# Altium schematic sheet CE842170260_SHEET2.SchDoc
size Tabloid; Revision: P; SheetNumber: 1; SheetTotal: 1; PageSetup: Record=PageOptions|CenterHorizontal=True|CenterVertical=True|PrintScale=0.75|XCorrection=1.00|YCorrection=1.00|PrintKind=0|BorderSize=5000000|LeftOffset=0|BottomOffset=0|Orientation=2|PaperLength=1000|PaperWidth=1000|Scale=100|PaperSource=7|PrintQuality=-4|MediaType=1|DitherType=10|PaperKind=A4|PrintScaleMode=1; Rule: PcbType=ProtelPcb
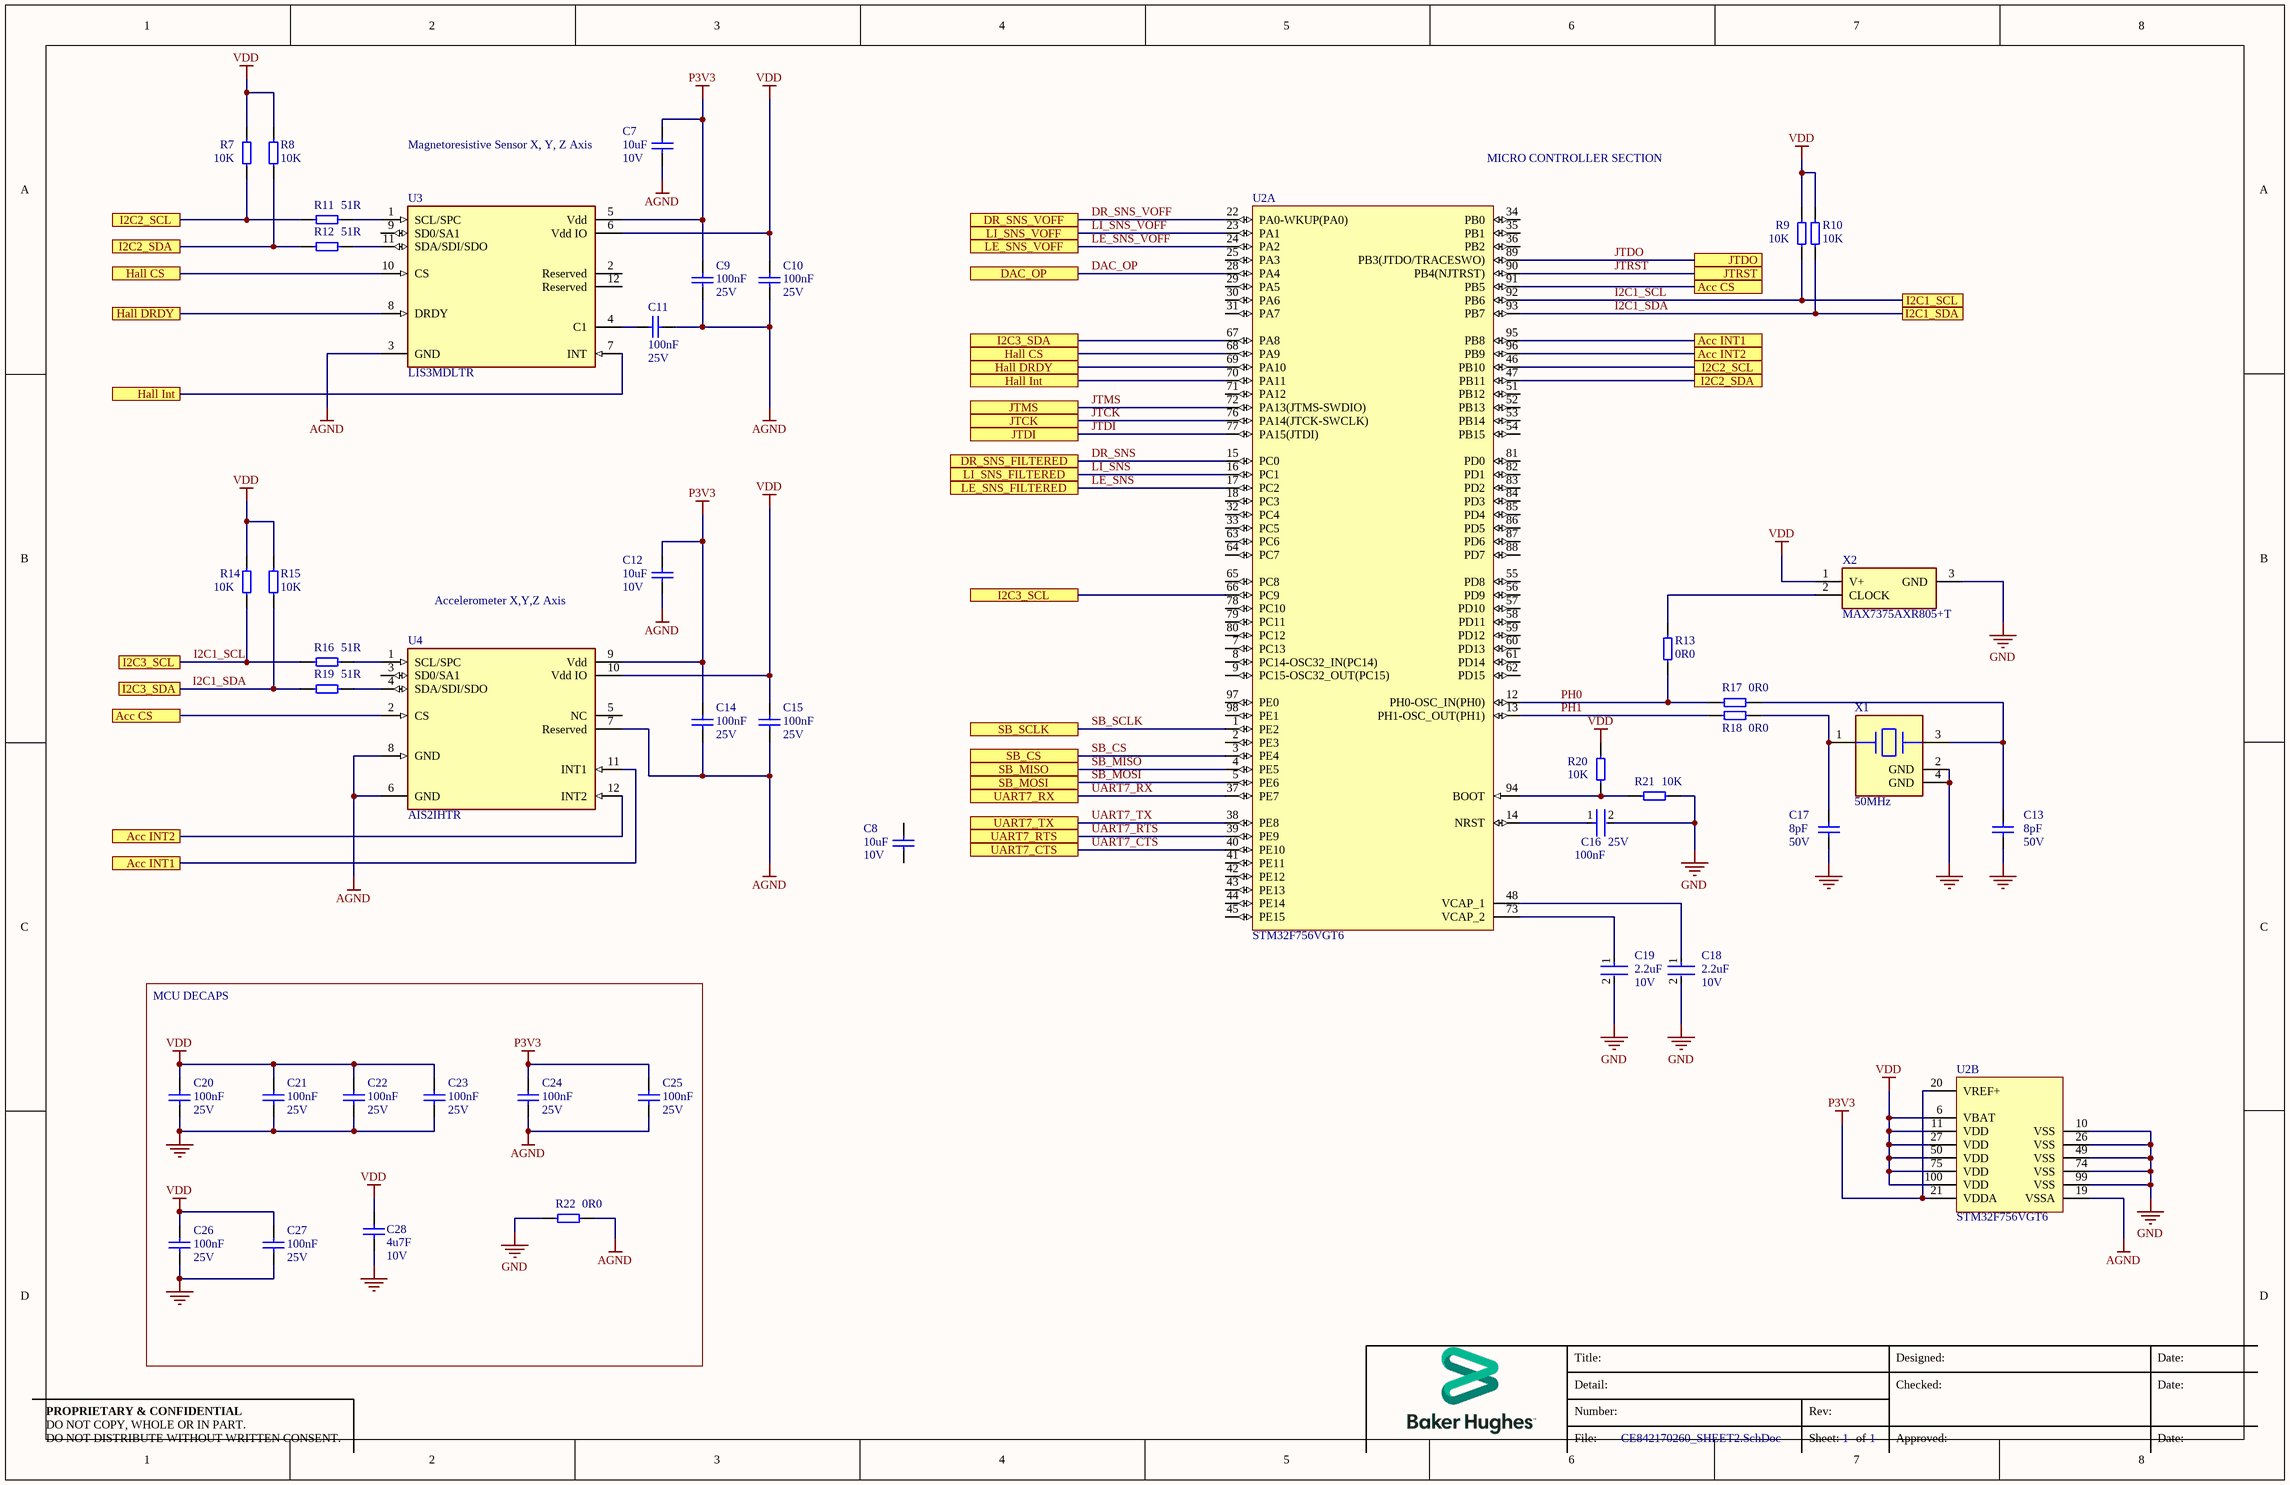
[diagram p0: CE842170260_SHEET2.SchDoc]

## Parts
C7  value 10uF  Voltage: 10V  [C0603]  (hidden comment: KK/96159/3701)
C8  value 10uF  Voltage: 10V  [C0603]  (hidden comment: KK/96159/3701)
C9  value 100nF  Voltage: 25V  [C0603]  (hidden comment: KK/96159/4501)
C10  value 100nF  Voltage: 25V  [C0603]  (hidden comment: KK/96159/4501)
C11  value 100nF  Voltage: 25V  [C0603]  (hidden comment: KK/96159/4501)
C12  value 10uF  Voltage: 10V  [C0603]  (hidden comment: KK/96159/3701)
C13  value 8pF  Voltage: 50V  [C0603]  (hidden comment: KK/96159/0088)
C14  value 100nF  Voltage: 25V  [C0603]  (hidden comment: KK/96159/4501)
C15  value 100nF  Voltage: 25V  [C0603]  (hidden comment: KK/96159/4501)
C16  Voltage Rating (DC): 25V  Capacitance: 100nF  [FP-C1005-050-0_05-MFG]  (hidden comment: C1005X5R1E104K050BC)
C17  value 8pF  Voltage: 50V  [C0603]  (hidden comment: KK/96159/0088)
C18  Voltage Rating: 10V  Capacitance: 2.2uF  [FP-CGB3B-IPC_A]  (hidden comment: CGB3B3X5R1A225M055AB)
C19  Voltage Rating: 10V  Capacitance: 2.2uF  [FP-CGB3B-IPC_A]  (hidden comment: CGB3B3X5R1A225M055AB)
C20  value 100nF  Voltage: 25V  [C0603]  (hidden comment: KK/96159/4501)
C21  value 100nF  Voltage: 25V  [C0603]  (hidden comment: KK/96159/4501)
C22  value 100nF  Voltage: 25V  [C0603]  (hidden comment: KK/96159/4501)
C23  value 100nF  Voltage: 25V  [C0603]  (hidden comment: KK/96159/4501)
C24  value 100nF  Voltage: 25V  [C0603]  (hidden comment: KK/96159/4501)
C25  value 100nF  Voltage: 25V  [C0603]  (hidden comment: KK/96159/4501)
C26  value 100nF  Voltage: 25V  [C0603]  (hidden comment: KK/96159/4501)
C27  value 100nF  Voltage: 25V  [C0603]  (hidden comment: KK/96159/4501)
C28  value 4u7F  Voltage: 10V  [C0603]  (hidden comment: KK/96159/2666)
R7  value 10K  [R0603]  (hidden comment: KK/96059/0601)
R8  value 10K  [R0603]  (hidden comment: KK/96059/0601)
R9  value 10K  [R0603]  (hidden comment: KK/96059/0601)
R10  value 10K  [R0603]  (hidden comment: KK/96059/0601)
R11  value 51R  [R0603]  (hidden comment: KK/96059/1369)
R12  value 51R  [R0603]  (hidden comment: KK/96059/1369)
R13  value 0R0  [R0603]  (hidden comment: KK/96059/0000)
R14  value 10K  [R0603]  (hidden comment: KK/96059/0601)
R15  value 10K  [R0603]  (hidden comment: KK/96059/0601)
R16  value 51R  [R0603]  (hidden comment: KK/96059/1369)
R17  value 0R0  [R0603]  (hidden comment: KK/96059/0000)
R18  value 0R0  [R0603]  (hidden comment: KK/96059/0000)
R19  value 51R  [R0603]  (hidden comment: KK/96059/1369)
R20  value 10K  [R0603]  (hidden comment: KK/96059/0601)
R21  value 10K  [R0603]  (hidden comment: KK/96059/0601)
R22  value 0R0  [R0603]  (hidden comment: KK/96059/0000)
U2  MF_PartNumber: STM32F756VGT6  [LQFP-100]  (hidden comment: KK/95414/0147)  (parts A,B of 2)
U3  MF_PartNumber: LIS3MDLTR  [LGA-12]  (hidden comment: KK/95312/0195)
U4  MF_PartNumber: AIS2IHTR  [LGA-12]  (hidden comment: KK/95312/0196)
X1  Frequency: 50MHz  [FP-NX1612SA-MFG]  (hidden comment: NX1612SA-50M-EXS00A-CS08403)
X2  MAX7375AXR805+T  [SOT65P210X110-3N]

## Blocks framed on the sheet
MCU DECAPS: C20-C28 R22

## Ports
Acc CS, Acc INT1, Acc INT2, DAC_OP, DR_SNS_FILTERED, DR_SNS_VOFF, Hall CS, Hall DRDY, Hall Int, I2C1_SCL, I2C1_SDA, I2C2_SCL, I2C2_SDA, I2C3_SCL, I2C3_SDA, JTCK, JTDI, JTDO, JTMS, JTRST, LE_SNS_FILTERED, LE_SNS_VOFF, LI_SNS_FILTERED, LI_SNS_VOFF, SB_CS, SB_MISO, SB_MOSI, SB_SCLK, UART7_CTS, UART7_RTS, UART7_RX, UART7_TX

## Nets
AGND: C7.2 C9.2 C10.2 C11.2 C12.2 C14.2 C15.2 C24.2 C25.2 R22.2 U2.19(VSSA) U3.3(GND) U4.6(GND) U4.7(Reserved) U4.8(GND)
GND: C13.1 C16.2 C17.2 C18.2 C19.2 C20.2 C21.2 C22.2 C23.2 C26.2 C27.2 C28.2 R21.1 R22.1 U2.10(VSS) U2.26(VSS) U2.49(VSS) U2.74(VSS) U2.99(VSS) X1.2(GND) X1.4(GND) X2.3(GND)
P3V3: C7.1 C9.1 C12.1 C14.1 C24.1 C25.1 U2.20(VREF+) U2.21(VDDA) U3.5(Vdd) U4.9(Vdd)
VDD: C10.1 C15.1 C20.1 C21.1 C22.1 C23.1 C26.1 C27.1 C28.1 R7.2 R8.2 R9.2 R10.2 R14.2 R15.2 R20.2 U2.6(VBAT) U2.11(VDD) U2.27(VDD) U2.50(VDD) U2.75(VDD) U2.100(VDD) U3.6(Vdd_IO) U4.10(Vdd_IO) X2.1(V+)
Acc CS: U2.91(PB5) U4.2(CS) ; port Acc CS
Acc INT1: U2.95(PB8) U4.11(INT1) ; port Acc INT1
Acc INT2: U2.96(PB9) U4.12(INT2) ; port Acc INT2
DAC_OP: U2.28(PA4) ; port DAC_OP
DR_SNS: U2.15(PC0) ; port DR_SNS_FILTERED
DR_SNS_VOFF: U2.22(PA0-WKUP(PA0)) ; port DR_SNS_VOFF
Hall CS: U2.68(PA9) U3.10(CS) ; port Hall CS
Hall DRDY: U2.69(PA10) U3.8(DRDY) ; port Hall DRDY
Hall Int: U2.70(PA11) U3.7(INT) ; port Hall Int
I2C1_SCL: R9.1 R14.1 R16.1 U2.66(PC9) U2.92(PB6) ; port I2C1_SCL, port I2C3_SCL
I2C1_SDA: R10.1 R15.1 R19.1 U2.67(PA8) U2.93(PB7) ; port I2C1_SDA, port I2C3_SDA
I2C2_SCL: R7.1 R11.1 U2.46(PB10) ; port I2C2_SCL
I2C2_SDA: R8.1 R12.1 U2.47(PB11) ; port I2C2_SDA
JTCK: U2.76(PA14(JTCK-SWCLK)) ; port JTCK
JTDI: U2.77(PA15(JTDI)) ; port JTDI
JTDO: U2.89(PB3(JTDO/TRACESWO)) ; port JTDO
JTMS: U2.72(PA13(JTMS-SWDIO)) ; port JTMS
JTRST: U2.90(PB4(NJTRST)) ; port JTRST
LE_SNS: U2.17(PC2) ; port LE_SNS_FILTERED
LE_SNS_VOFF: U2.24(PA2) ; port LE_SNS_VOFF
LI_SNS: U2.16(PC1) ; port LI_SNS_FILTERED
LI_SNS_VOFF: U2.23(PA1) ; port LI_SNS_VOFF
PH0: R13.2 R17.1 U2.12(PH0-OSC_IN(PH0))
PH1: R18.1 U2.13(PH1-OSC_OUT(PH1))
SB_CS: U2.3(PE4) ; port SB_CS
SB_MISO: U2.4(PE5) ; port SB_MISO
SB_MOSI: U2.5(PE6) ; port SB_MOSI
SB_SCLK: U2.1(PE2) ; port SB_SCLK
UART7_CTS: U2.40(PE10) ; port UART7_CTS
UART7_RTS: U2.39(PE9) ; port UART7_RTS
UART7_RX: U2.37(PE7) ; port UART7_RX
UART7_TX: U2.38(PE8) ; port UART7_TX
NetC11_1: C11.1 U3.4(C1)
NetC13_2: C13.2 R17.2 X1.3(2_Xtal)
NetC16_1: C16.1 U2.14(NRST)
NetC17_1: C17.1 R18.2 X1.1(1_Xtal)
NetC18_1: C18.1 U2.48(VCAP_1)
NetC19_1: C19.1 U2.73(VCAP_2)
NetR11_2: R11.2 U3.1(SCL/SPC)
NetR12_2: R12.2 U3.11(SDA/SDI/SDO)
NetR13_1: R13.1 X2.2(CLOCK)
NetR16_2: R16.2 U4.1(SCL/SPC)
NetR19_2: R19.2 U4.4(SDA/SDI/SDO)
NetR20_1: R20.1 R21.2 U2.94(BOOT)

Not connected (* = marked no-connect by the designer): C8 1 2; U2 2(PE3) 7(PC13) 8(PC14-OSC32_IN(PC14)) 9(PC15-OSC32_OUT(PC15)) 18(PC3) 25(PA3) 29(PA5) 30(PA6) 31(PA7) 32(PC4) 33(PC5) 34(PB0) 35(PB1) 36(PB2) 41(PE11) 42(PE12) 43(PE13) 44(PE14) 45(PE15) 51(PB12) 52(PB13) 53(PB14) 54(PB15) 55(PD8) 56(PD9) 57(PD10) 58(PD11) 59(PD12) 60(PD13) 61(PD14) 62(PD15) 63(PC6) 64(PC7) 65(PC8) 71(PA12) 78(PC10) 79(PC11) 80(PC12) 81(PD0) 82(PD1) 83(PD2) 84(PD3) 85(PD4) 86(PD5) 87(PD6) 88(PD7) 97(PE0) 98(PE1); U3 2(Reserved) 9(SD0/SA1) 12(Reserved); U4 3(SD0/SA1) 5(NC)

## Notes on the sheet
- (near C7) Magnetoresistive Sensor X, Y, Z Axis
- MICRO CONTROLLER SECTION
- Accelerometer X,Y,Z Axis
- Title:
- Designed:
- Date:
- PROPRIETARY & CONFIDENTIAL
- DO NOT COPY, WHOLE OR IN PART.
- Detail:
- Number:
- Rev:
- Checked:
- DO NOT DISTRIBUTE WITHOUT WRITTEN CONSENT.
- File:
- Sheet:
- of
- Approved:

## Library data of the parts
C7 C8 C12 = KK/96159/3701: CAPACITOR_10uF_10%_10V_0603; ID: 175; Tolerance: 10%; PII_PartNumber: KK/96159/3701; Pins: 2
C9-C11 C14 C15 C20-C27 = KK/96159/4501: CAPACITOR_100nF_+10%_25V_603; ID: 185; Tolerance: 10%; PII_PartNumber: KK/96159/4501; Pins: 2
C13 C17 = KK/96159/0088: CAPACITOR CERAMIC 0603 50V 5% NPO 8pF; ID: 570; PII_PartNumber: KK/96159/0088; Pins: 2; Tolerance: 5%
C16 = CMP-2000-06000-2: Multilayer Ceramic Capacitors 100nF ±10% 25V X5R SMD 0402; Case Code (Imperial): 0402; Termination: Wraparound; Series: C; Depth: 0.5mm; Contact Plating: Tin; Case Code (Metric): 1005; Dielectric: X5R; Case/Package: 0402; Voltage Rating: 25V; Packaging: Tape and Reel; Thickness: 0.022inch; Dielectric Material: Ceramic; Height: 0.5mm; Weight: 2.3E-05oz; RoHS Compliant: Yes; Width: 0.02inch; Tolerance: 10%; Mount: Surface Mount; Package Quantity: 1; Max Operating Temperature: 85°C; Construction: Flat; Min Operating Temperature: -55°C; REACH SVHC: No SVHC; Resistor Type: Ceramic; Length: 1mm; Lead Free: Lead Free; Voltage: 25V
C18 C19 = CMP-08246-006382-1: Multilayer Ceramic Capacitors 2.2uF ±20% 10V X5R SMD 0603; Max Operating Temperature: 85°C; Length: 1.6mm; Case Code (Imperial): 0603; Termination: SMD/SMT; Weight: 7.1E-05oz; Mount: Surface Mount; Depth: 0.8mm; Packaging: Tape and Reel; RoHS Compliant: Yes; Series: CGB; Voltage Rating (DC): 10V; Dielectric: X5R; Case/Package: 0603; Case Code (Metric): 1608; Height: 0.55mm; Min Operating Temperature: -55°C; Thickness: 0.022inch; Tolerance: 20%; Width: 0.8mm; Package Quantity: 1; Lead Free: Lead Free
C28 = KK/96159/2666: CAPACITOR_4u7F_10%_10V_0603; ID: 165; Tolerance: 10%; PII_PartNumber: KK/96159/2666; Pins: 2
R7-R10 R14 R15 R20 R21 = KK/96059/0601: RESISTOR_10K_1%_0603J_63mW; ID: 1090; Tolerance: 1%; Power: 63mW; PII_PartNumber: KK/96059/0601; Pins: 2
R11 R12 R16 R19 = KK/96059/1369: RESISTOR_51R_1%_0603J_63mW; ID: 1148; Tolerance: 1%; Power: 63mW; Temp_Coeff: 100ppm; PII_PartNumber: KK/96059/1369; Pins: 2
R13 R17 R18 R22 = KK/96059/0000: ZERO OHM LINK; ID: 7; Power: 63mW; PII_PartNumber: KK/96059/0000; Pins: 2
U2 = KK/95414/0147: MICROCONTROLLER MCU; Manufacturer: STMICROELECTRONICS; Manufacturer Part Number: STM32F756VGT6U; D/A Converter: 2; I/Os (High Current): 82; Core: ARM Cortex-M7; Packing: Tray; Supply Voltage(Vcc) min (V): 1.7; Operating Frequency(F) (Processor speed) (MHz): 216; Internal RAM Size (kB): 320; FLASH Size (Prog) (kB): 1024; ID: 81; Value: 1MB/32BIT; Voltage: 1.7-3.6V; ComponentLink2Description: Datasheet; DatasheetVersion: Rev. 4; ComponentLink1URL: http://www.st.com/; Package Description: 100-Pin Low Profile Quad Flat Package, Body 14 x 14 mm, Pitch 0.5 mm; ComponentLink1Description: Manufacturer URL; Mounting Technology: Surface Mount; ComponentLink2URL: http://www.st.com/st-web-ui/static/active/en/resource/technical/document/datasheet/DM00166114.pdf; Package Reference: LQFP100; Manufacturer Part Number: STM32F756VGT6; Manufacturer: STMicroelectronics; PII_PartNumber: KK/95414/0147; Pins: 100; Temperature: -40 to +85C
U3 = KK/95312/0195: 3 AXIS MAGNETIC SENSOR; Manufacturer: STMicroelectronics; Sensor Output: I2C,SPI; Operating Supply Current: 40-270uA; Max Supply Voltage: 3.6V; Min Supply Voltage: 1.71V; ID: 103; Voltage: 1.9 - 3.6V; ComponentLink2URL: https://www.st.com/resource/en/datasheet/lis3mdl.pdf; Category: IC; Manufacturer Part Number: LIS3MDLTR; Octopart: https://octopart.com/lis3mdltr-stmicroelectronics-29403125; Automotive: No; Sensing Method: Magnetic; ComponentLink2Description: Datasheet; RoHS: TRUE; Device Class L3: unset; Device Class L1: Sensors; Temperature: -40 to +85C; Height: 1mm; Mouser Description: Board Mount Hall Effect / Magnetic Sensors Ultra Lo-Pwr Hi Perf 3-Axis 1.9-3.6V; Temperature Range High: +85°C; Lead Free: Yes; Device Class L2: Magnetic Sensors; Footprint Url: https://www.st.com/content/ccc/resource/technical/document/technical_note/73/17/9c/16/dd/96/4a/01/CD00134799.pdf/files/CD00134799.pdf/jcr:content/translations/en.CD00134799.pdf; Temperature Range Low: -40°C; Package: VFLGA-12-8365767; Digikey Description: SENSOR MR I2C/SPI 12LGA; PII_PartNumber: KK/95312/0195; Pins: 12
U4 = KK/95312/0196: 3 AXIS DIGITAL ACCELEROMETER 14BIT; Manufacturer: STMicroelectronics; Sensor Output: I2C,SPI; Operating Supply Current: 0.67-110uA; Max Supply Voltage: 3.6V; Sensing Method: X,Y,Z; Min Supply Voltage: 1.62V; ID: 102; Voltage: 1.62 - 3.6V; ComponentLink2URL: https://www.st.com/resource/en/datasheet/lis3mdl.pdf; Category: IC; Octopart: https://www.mouser.co.uk/datasheet/2/389/dm00462829-2042226.pdf; Automotive: YES; ComponentLink2Description: Datasheet; RoHS: TRUE; Device Class L3: unset; Device Class L1: Sensors; Temperature: -40 to +115C; Height: 1mm; Mouser Description: Board Mount Hall Effect / Magnetic Sensors Ultra Lo-Pwr Hi Perf 3-Axis 1.9-3.6V; Temperature Range High: +85°C; Lead Free: Yes; Device Class L2: Magnetic Sensors; Footprint Url: https://www.st.com/content/ccc/resource/technical/document/technical_note/73/17/9c/16/dd/96/4a/01/CD00134799.pdf/files/CD00134799.pdf/jcr:content/translations/en.CD00134799.pdf; Temperature Range Low: -40°C; Package: VFLGA-12-8365767; Digikey Description: SENSOR MR I2C/SPI 12LGA; PII_PartNumber: KK/95312/0196; Pins: 12
X1 = CMP-200220-000009-1: CRYSTAL 50MHZ 8PF SMD; ESR (Equivalent Series Resistance): 80R; Frequency Stability: 15ppm; Frequency Tolerance: 10ppm; Case/Package: SMD/SMT; Min Operating Temperature: -30°C; Packaging: Cut Tape; Max Operating Temperature: 85°C; Mount: Surface Mount; Load Capacitance: 8pF
X2 = MAX7375AXR805+T: MAXIM INTEGRATED PRODUCTS - MAX7375AXR805+T - OSCILLATOR, 8MHZ, 5.5V, SC-70-3; Manufacturer_Name: Analog Devices; Geometry.Height: 1.1mm; Manufacturer_Part_Number: MAX7375AXR805+T; Mouser Part Number: 700-MAX7375AXR805+T; Mouser Price/Stock: https://www.mouser.co.uk/ProductDetail/Maxim-Integrated/MAX7375AXR805%2bT?qs=1eQvB6Dk1vjChWERGxp2Mg%3D%3D; Arrow Part Number: MAX7375AXR805+T; Arrow Price/Stock: https://www.arrow.com/en/products/max7375axr805t/maxim-integrated?region=nac; Mouser Testing Part Number: *; Mouser Testing Price/Stock: *; Datasheet Link: https://datasheets.maximintegrated.com/en/ds/MAX7375.pdf